# Altium project controladorVooDrone.PrjPcb
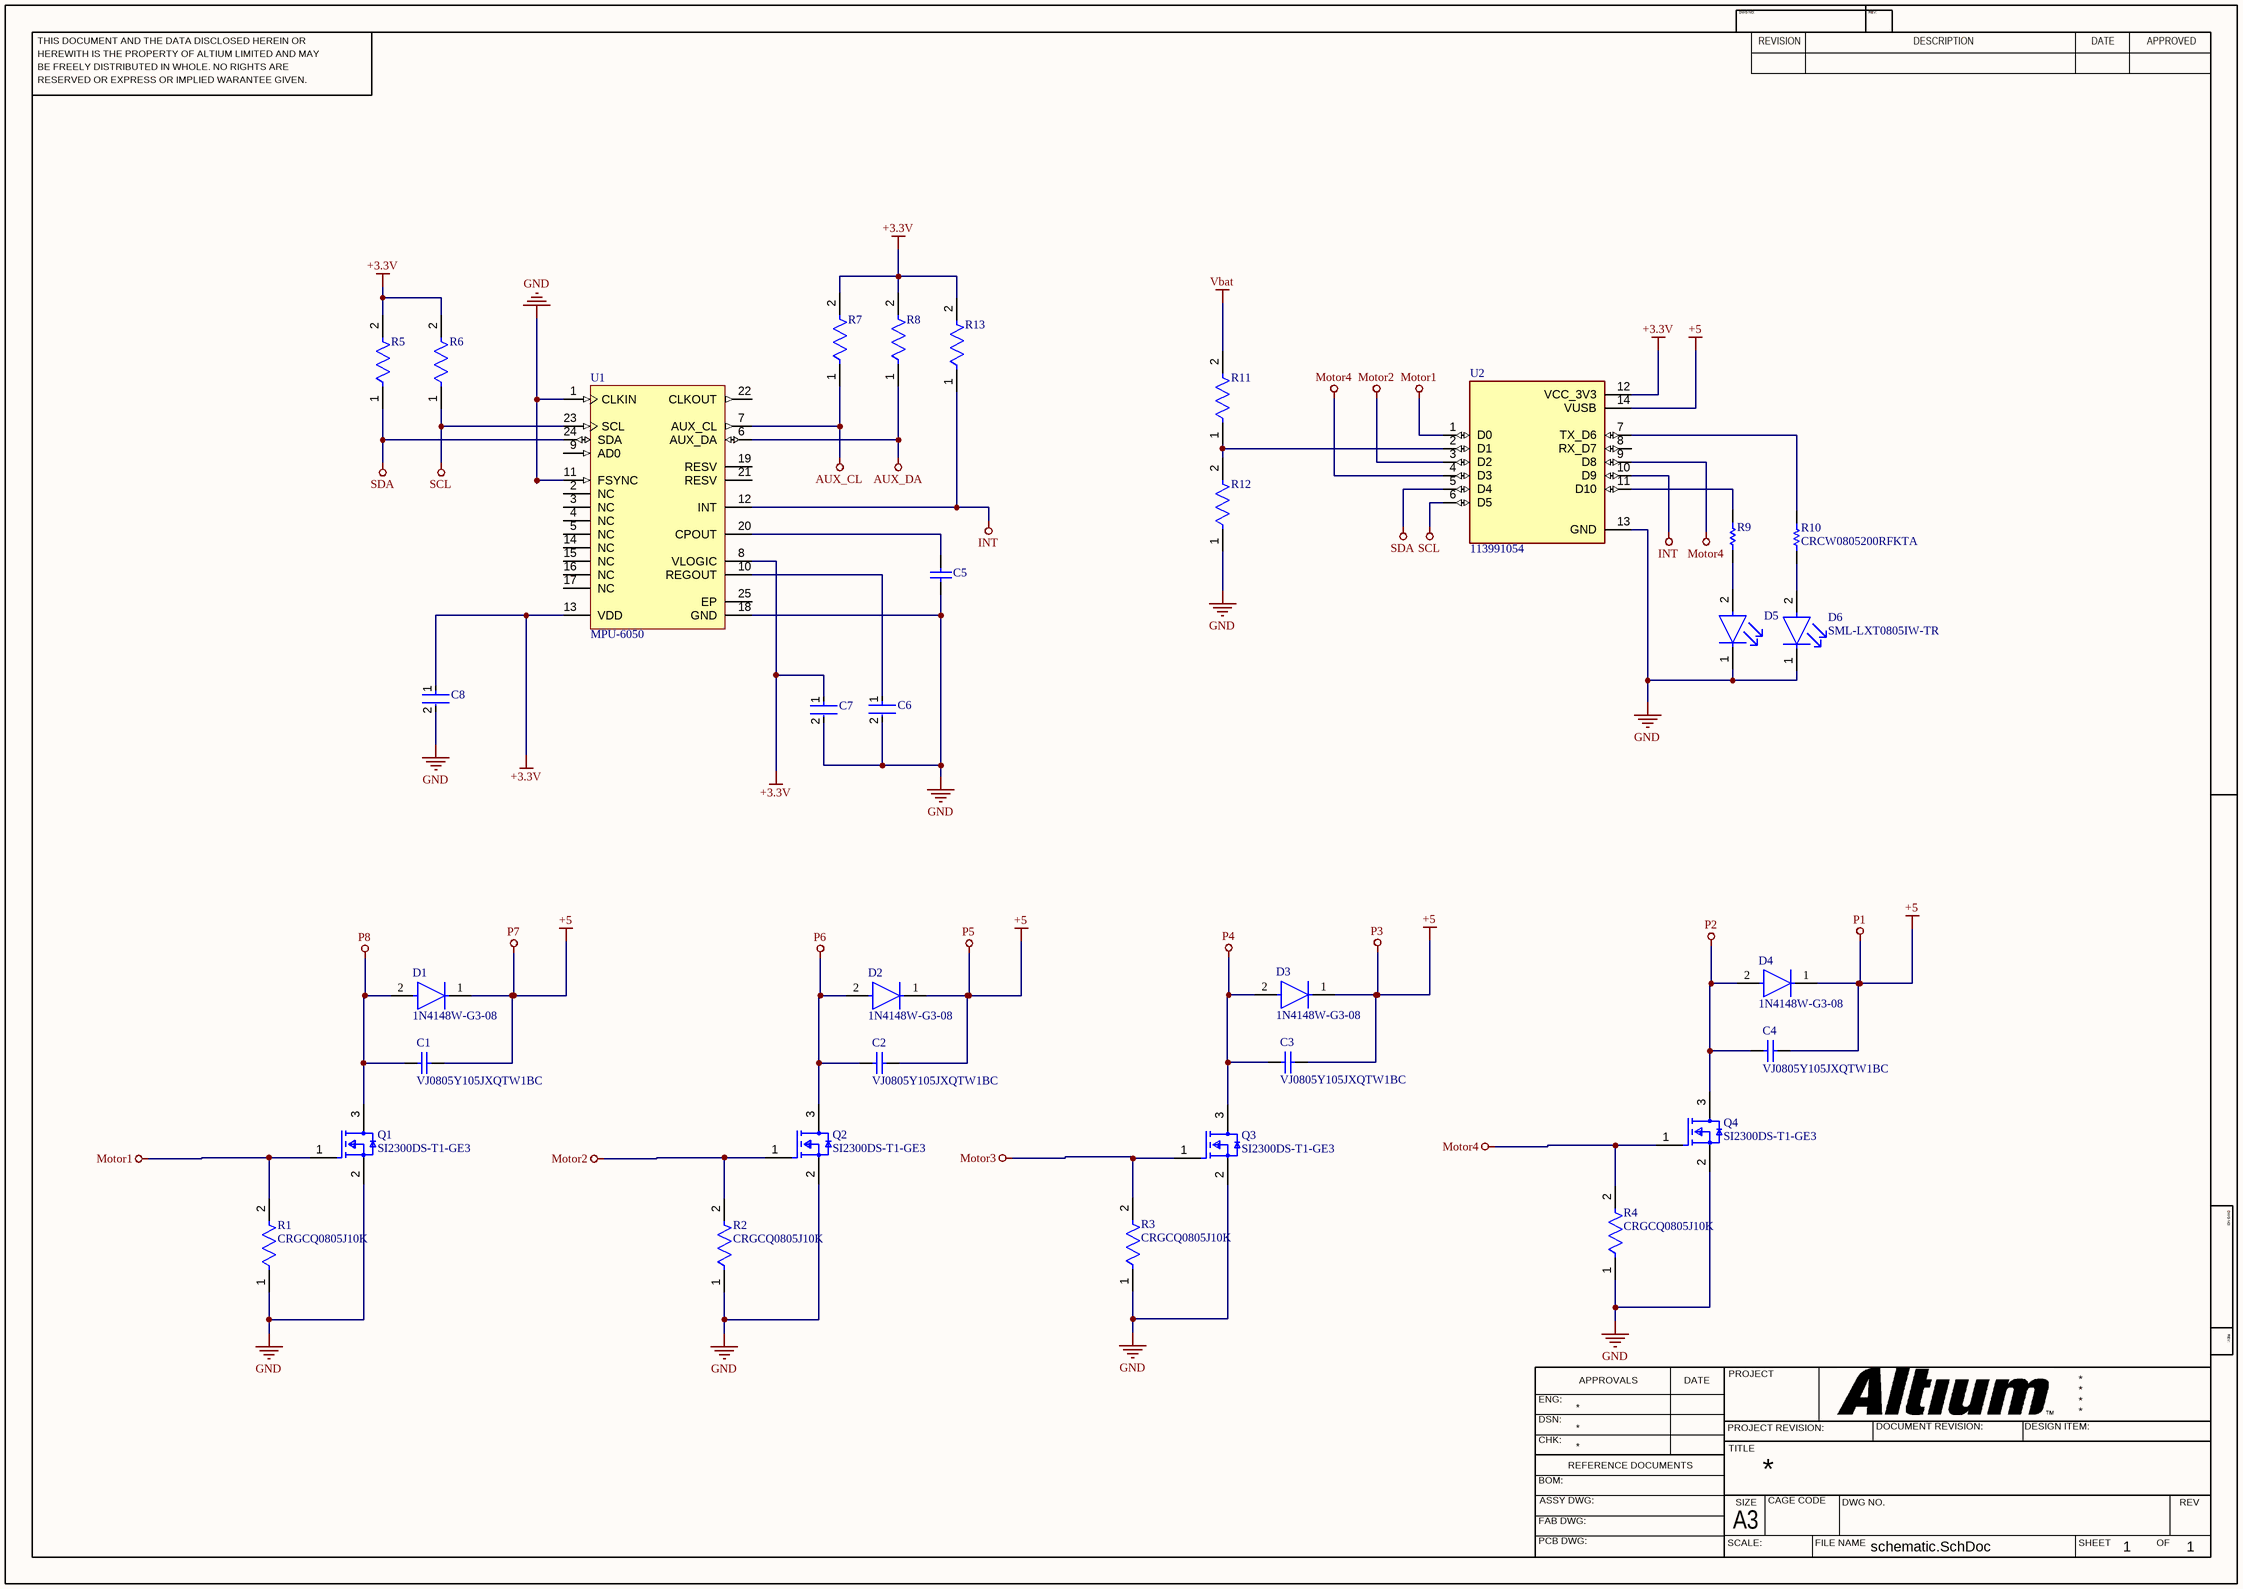
[diagram p0: schematic.SchDoc]
1 sheet, 33 parts. Net scope: global (net labels, ports and power ports of the same name join across sheets).
Board file: controladorVooDrone.PcbDoc

## Sheet schematic.SchDoc
size 420 x 297 mm; SheetNumber: 1; SheetTotal: 1

### Parts
C1  VJ0805Y105JXQTW1BC  [CAPC2013X145X50LL20T20]
C2  VJ0805Y105JXQTW1BC  [CAPC2013X145X50LL20T20]
C3  VJ0805Y105JXQTW1BC  [CAPC2013X145X50LL20T20]
C4  VJ0805Y105JXQTW1BC  [CAPC2013X145X50LL20T20]
C5  VJ0805Y221KXAPW1BC  [CAPC2013X145X50NL20T20]  (value not drawn)
C6  GRM033R61A104KE15D  [FP-GRM033-0_03-IPC_C]  (value not drawn)
C7  GRM033R61A104KE15D  [FP-GRM033-0_03-IPC_C]  (value not drawn)
C8  GRM033R61A104KE15D  [FP-GRM033-0_03-IPC_C]  (value not drawn)
D1  1N4148W-G3-08  [FP-S8-V-3910_01-001-MFG]
D2  1N4148W-G3-08  [FP-S8-V-3910_01-001-MFG]
D3  1N4148W-G3-08  [FP-S8-V-3910_01-001-MFG]
D4  1N4148W-G3-08  [FP-S8-V-3910_01-001-MFG]
D5  APHCM2012CGCK-F01  [FP-APHCM2012CGCK-F01-MFG]  (value not drawn)
D6  SML-LXT0805IW-TR  [FP-SML-LXT0805IW-TR-MFG]
Q1  SI2300DS-T1-GE3  [FP-S-03946-MFG]
Q2  SI2300DS-T1-GE3  [FP-S-03946-MFG]
Q3  SI2300DS-T1-GE3  [FP-S-03946-MFG]
Q4  SI2300DS-T1-GE3  [FP-S-03946-MFG]
R1  CRGCQ0805J10K  [FP-CRGCQ0805-IPC_C]
R2  CRGCQ0805J10K  [FP-CRGCQ0805-IPC_C]
R3  CRGCQ0805J10K  [FP-CRGCQ0805-IPC_C]
R4  CRGCQ0805J10K  [FP-CRGCQ0805-IPC_C]
R5  CRGCQ0805J10K  [FP-CRGCQ0805-IPC_C]  (value not drawn)
R6  CRGCQ0805J10K  [FP-CRGCQ0805-IPC_C]  (value not drawn)
R7  CRGCQ0805J10K  [FP-CRGCQ0805-IPC_C]  (value not drawn)
R8  CRGCQ0805J10K  [FP-CRGCQ0805-IPC_C]  (value not drawn)
R9  CRCW0805200RFKTA  [RESC2013X50X30NL20T20]  (value not drawn)
R10  CRCW0805200RFKTA  [RESC2013X50X30NL20T20]
R11  CRGCQ0805J10K  [FP-CRGCQ0805-IPC_C]  (value not drawn)
R12  CRGCQ0805J10K  [FP-CRGCQ0805-IPC_C]  (value not drawn)
R13  CRGCQ0805J10K  [FP-CRGCQ0805-IPC_C]  (value not drawn)
U1  MPU-6050  [IS-QFN-24_V]
U2  113991054  [MODULE_113991054]

### Nets
+3.3V: C7.1 C8.1 R5.2 R6.2 R7.2 R8.2 R13.2 U1.8(VLOGIC) U1.13(VDD) U2.12(VCC_3V3)
+5: C1.2 C2.2 C3.2 C4.2 D1.1(C) D2.1(C) D3.1(C) D4.1(C) U2.14(VUSB)  [also labelled P1, P3, P5, P7]
AUX_CL: R7.1 U1.7(AUX_CL)
AUX_DA: R8.1 U1.6(AUX_DA)
GND: C5.1 C6.2 C7.2 C8.2 D5.1(C) D6.1(C) Q1.2(S) Q2.2(S) Q3.2(S) Q4.2(S) R1.1 R2.1 R3.1 R4.1 R12.1 U1.1(CLKIN) U1.11(FSYNC) U1.18(GND) U2.13(GND)
INT: R13.1 U1.12(INT) U2.10(D9)
Motor1: Q1.1(G) R1.2 U2.1(D0)
Motor2: Q2.1(G) R2.2 U2.3(D2)
Motor3: Q3.1(G) R3.2
Motor4: Q4.1(G) R4.2 U2.4(D3) U2.9(D8)
P2: C4.1 D4.2(A) Q4.3(D)
P4: C3.1 D3.2(A) Q3.3(D)
P6: C2.1 D2.2(A) Q2.3(D)
P8: C1.1 D1.2(A) Q1.3(D)
SCL: R6.1 U1.23(SCL) U2.6(D5)
SDA: R5.1 U1.24(SDA) U2.5(D4)
Vbat: R11.2
NetC5_2: C5.2 U1.20(CPOUT)
NetC6_1: C6.1 U1.10(REGOUT)
NetD5_2: D5.2(A) R9.1
NetD6_2: D6.2(A) R10.1
NetR9_2: R9.2 U2.11(D10)
NetR10_2: R10.2 U2.7(TX_D6)
NetR11_1: R11.1 R12.2 U2.2(D1)

Not connected (* = marked no-connect by the designer): U1 2(NC) 3(NC) 4(NC) 5(NC) 9(AD0) 14(NC) 15(NC) 16(NC) 17(NC) 19(RESV) 21(RESV) 22(CLKOUT) 25(EP); U2 8(RX_D7)

### Notes on the sheet
- THIS DOCUMENT AND THE DATA DISCLOSED HEREIN OR
- HEREWITH IS THE PROPERTY OF ALTIUM LIMITED AND MAY
- DWG NO:
- REVISION
- REV:
- DESCRIPTION
- DATE
- APPROVED
- BE FREELY DISTRIBUTED IN WHOLE. NO RIGHTS ARE
- RESERVED OR EXPRESS OR IMPLIED WARANTEE GIVEN.
- ENG:
- APPROVALS
- PROJECT
- DSN:
- CHK:
- REFERENCE DOCUMENTS
- PROJECT REVISION:
- TITLE
- DOCUMENT REVISION:
- DESIGN ITEM:
- BOM:
- FAB DWG:
- PCB DWG:
- ASSY DWG:
- SCALE:
- A3
- SIZE
- CAGE CODE
- FILE NAME
- DWG NO.
- SHEET
- OF
- REV

### Library data of the parts
C1-C4 = CMP-1036-04736-2: Manufacturer: Vitramon; Part Number: VJ0805Y105JXQTW1BC
C5 = CMP-2007-01635-1: Manufacturer: Vitramon; Part Number: VJ0805Y221KXAPW1BC
C6-C8 = CMP-2010-01264-2: Chip Multilayer Ceramic Capacitors for General Purpose, 0201, 0.10uF, X5R, 15%, 10%, 10V; Capacitance: 100nF; Mount: Surface Mount; Dielectric: X5R; Width: 0.012inch; Tolerance: 10%; Radiation Hardening: No; Voltage Rating: 10V; REACH SVHC: No SVHC; Height: 0.3mm; Max Operating Temperature: 85°C; Voltage Rating (DC): 10V; Thickness: 0.013inch; Termination: SMD/SMT; Lead Free: Lead Free; Package Quantity: 1; Case/Package: 0201; Min Operating Temperature: -55°C; Weight: 6E-06oz; Length: 0.6mm; Case Code (Imperial): 0201; Depth: 0.3mm; Voltage: 10V; Packaging: Tape and Reel; Case Code (Metric): 0603
D1-D4 = CMP-00030-46456310-1: 1N4148W-G3-08 Rectifier Diode, 1 Phase, 1 Element, 0.15A, 100V V(RRM), Silicon; Forward Current: 150mA; Reverse Recovery Time: 4ns; Peak Non-Repetitive Surge Current: 500mA; Element Configuration: Single; Forward Voltage: 1.2V; Max Reverse Voltage (DC): 75V; Schedule B: 8541100070, 8541100070; Max Repetitive Reverse Voltage (Vrrm): 100V; Weight: 9.412042mg; NexarPartId: 46456310; Contact Plating: Tin; Max Operating Temperature: 150°C; Case/Package: SOD; Mount: Surface Mount; RoHS: Compliant; Min Operating Temperature: -55°C; Average Rectified Current: 150mA; Number of Pins: 2
D5 = CMP-44529-000062-1: LED GREEN CLEAR CHIP SMD; Dominant Wavelength: 570nm; Forward Current: 20mA; Number of LEDs: 1; Luminous Intensity: 40mcd; Forward Voltage: 2.1V; Viewing Angle: 110°; Illumination Color: Green; Lens Style: Clear; Mount: Surface Mount; Length: 2mm; Max Operating Temperature: 85°C; Series: APHCM; Width: 1.25mm; Lead Free: Lead Free; Wavelength: 570nm; Package Quantity: 1; Number of Pins: 2; Case Code (Metric): 2012; RoHS Compliant: Yes; Packaging: Tape and Reel; Lens Color: Clear; Case/Package: 0805; Case Code (Imperial): 0805; Test Current: 20mA; Color: Green; Min Operating Temperature: -40°C; Height: 0.4mm
D6 = CMP-1724-00002-2: LED RED DIFFUSED SMD; Lens Style: Rectangular; Luminous Intensity: 11mcd; Approvals: UL; Test Current: 20mA; Forward Voltage: 2V; Number of LEDs: 1; Wavelength: 635nm; Lens Color: White; Viewing Angle: 140°; Min Operating Temperature: -25°C; Case Code (Metric): 2012; Mount: Surface Mount; Case Code (Imperial): 0805; Height: 0.8mm; Lead Free: Lead Free; Color: Red; Package Quantity: 1; Illumination Color: Red; Lens Transparency: Diffused; Forward Current: 20mA; Packaging: Tape and Reel; Length: 2mm; Case/Package: 0805; REACH SVHC: No SVHC; Width: 1.25mm; Number of Pins: 2; Max Operating Temperature: 80°C; Dominant Wavelength: 635nm
Q1-Q4 = CMP-02550-000182-1: MOSFET N-CH 30V 3.6A SOT-23; Manufacturer: Vishay; Threshold Vgs Max: 1.5V; Max Forward Diode Voltage: 1.2V; Max Junction Temp: +150°C; Reverse Recovery Time: 11ns; Depletion Mode: False; Standoff Height: 0.01mm; Gate To Source Voltage: 12V; Input Capacitace At Vds: 320pF @ 15V; Turn Off Delay Time: 15ns; Threshold Vgs Min: 0.6V; Transconductance: 13S; Gate Charge At Vgs: 6.5nC @ 10V; Power Dissipation: 1.1W; Drain To Source Resistance: 0.055Ω; Number Of N Channels: 1; Pulse Drain Current: 15A; Continuous Drain Current: 3.1A; Typ Forward Diode Voltage: 0.8V; Reverse Recovery Charge: 5nC; Rthja Max: 90°C/W; Turn On Delay Time: 5ns; Device Class L2: Transistors; Digikey Description: MOSFET N-CH 30V 3.6A SOT-23; Device Class L3: MOSFETs; ComponentLink2Description: Datasheet; Height: 1.12mm; Temperature Range Low: -55°C; Package: S-03946; Device Class L1: Discrete Semiconductors; RoHS: TRUE; ComponentLink2URL: http://www.vishay.com/docs/65701/si2300ds.pdf; Category: Trans; Drain To Source Breakdown Voltage: 30V; Automotive: No; Number Of Channels: 1; Mouser Description: MOSFET 30V 3.6A N-CH MOSFET; Temperature: -55°C to +150°C; Manufacturer Part Number: SI2300DS-T1-GE3; Octopart: https://octopart.com/si2300ds-t1-ge3-vishay-44451512; Drain To Source Voltage: 30V; Lead Free: Yes; Temperature Range High: +150°C; Ipc Land Pattern Name: SOT95P237X100-3
R1-R8 R11-R13 = CMP-03211-002989-1: CRGCQ 0805 10K 5%; Manufacturer: TE Connectivity; Voltage Rating: 150V; Temperature Coefficient: ±100ppm/°C; Resistance: 10KΩ; Value: 10KΩ; Power Rating: 0.125W; Tolerance: 0.05; Automotive Grade: Grade 914; Height: 0.65mm; Lead Free: Yes; Temperature Range High: +155°C; Composition: Thick Film; Temperature Range Low: -55°C; Ambient Temperature Range High: +70°C; Temperature: -55°C to +155°C; Package: CRGCQ0805; Device Class L2: Resistors; RoHS: TRUE; ComponentLink2URL: https://www.te.com/commerce/DocumentDelivery/DDEController?Action=showdoc&DocId=Data+Sheet%7F1773204-3%7F1%7Fpdf%7FEnglish%7FENG_DS_1773204-3_1.pdf%7F4-2176341-923; Manufacturer Part Number: CRGCQ0805J10K; Series: CRGCQ; Device Class L1: Passive Components; Ipc Land Pattern Name: RESC200125X55; ComponentLink2Description: Datasheet; Category: Res; Digikey Description: CRGCQ 0805 10K 5%; Mouser Description: Res Thick Film 0805 10K Ohm 5% 0.125W(1/8W) ±100ppm/C Pad SMD Automotive T/R; Automotive: Yes; Octopart: https://octopart.com/crgcq0805j10k-te+connectivity-91018201; Device Class L3: Chip SMD Resistors
R9 R10 = CMP-2001-04231-1: Manufacturer: Vishay Dale; Part Number: CRCW0805200RFKTA
U1 = CMP-1753-00002-2: 3-Axis Gyroscope, Accelerometer and a Digital Motion Processor(TM) (DMP), 2.375 to 3.46 V, -40 to 85 degC, 24-Pin QFN, RoHS, Tape and Reel; Manufacturer: InvenSense; Featured Product: MPU-60506-Axis,IntegratedI²CSolution; Other Names: 1428-1007-2 / MPU6050; Sensor Type: MotionTracking; Online Catalog: MPU-6000™Series; Unit PriceUSD: Digital; Datasheet Version: Rev. 3.3, 05/2012; Category: Sensors,Transducers; Datasheet URL: http://datasheet.octopart.com/MPU-6050-InvenSense-datasheet-14421344.pdf; Family: Multifunction; Standard Package: 5,000; Manufacturer URL: http://www.invensense.com/; Output Type: Digital; Dynamic Catalog: MPU-6000™Series
U2 = 113991054: - ESP32-C3 Transceiver; 802.11 a/b/g/n (Wi-Fi, WiFi, WLAN), BluetoothÂ® Smart 4.x Low Energy (BLE) 2.4GHz Evaluation Board; MF: Seeed Technology Co., Ltd; SnapEDA_Link: https://www.snapeda.com/parts/113991054/Seeed+Studio/view-part/?ref=snap; Package: None; Value: *; MP: 113991054; Check_prices: https://www.snapeda.com/parts/113991054/Seeed+Studio/view-part/?ref=eda